# Altium schematic sheet 2.Arduino Pinout.SchDoc
size A4
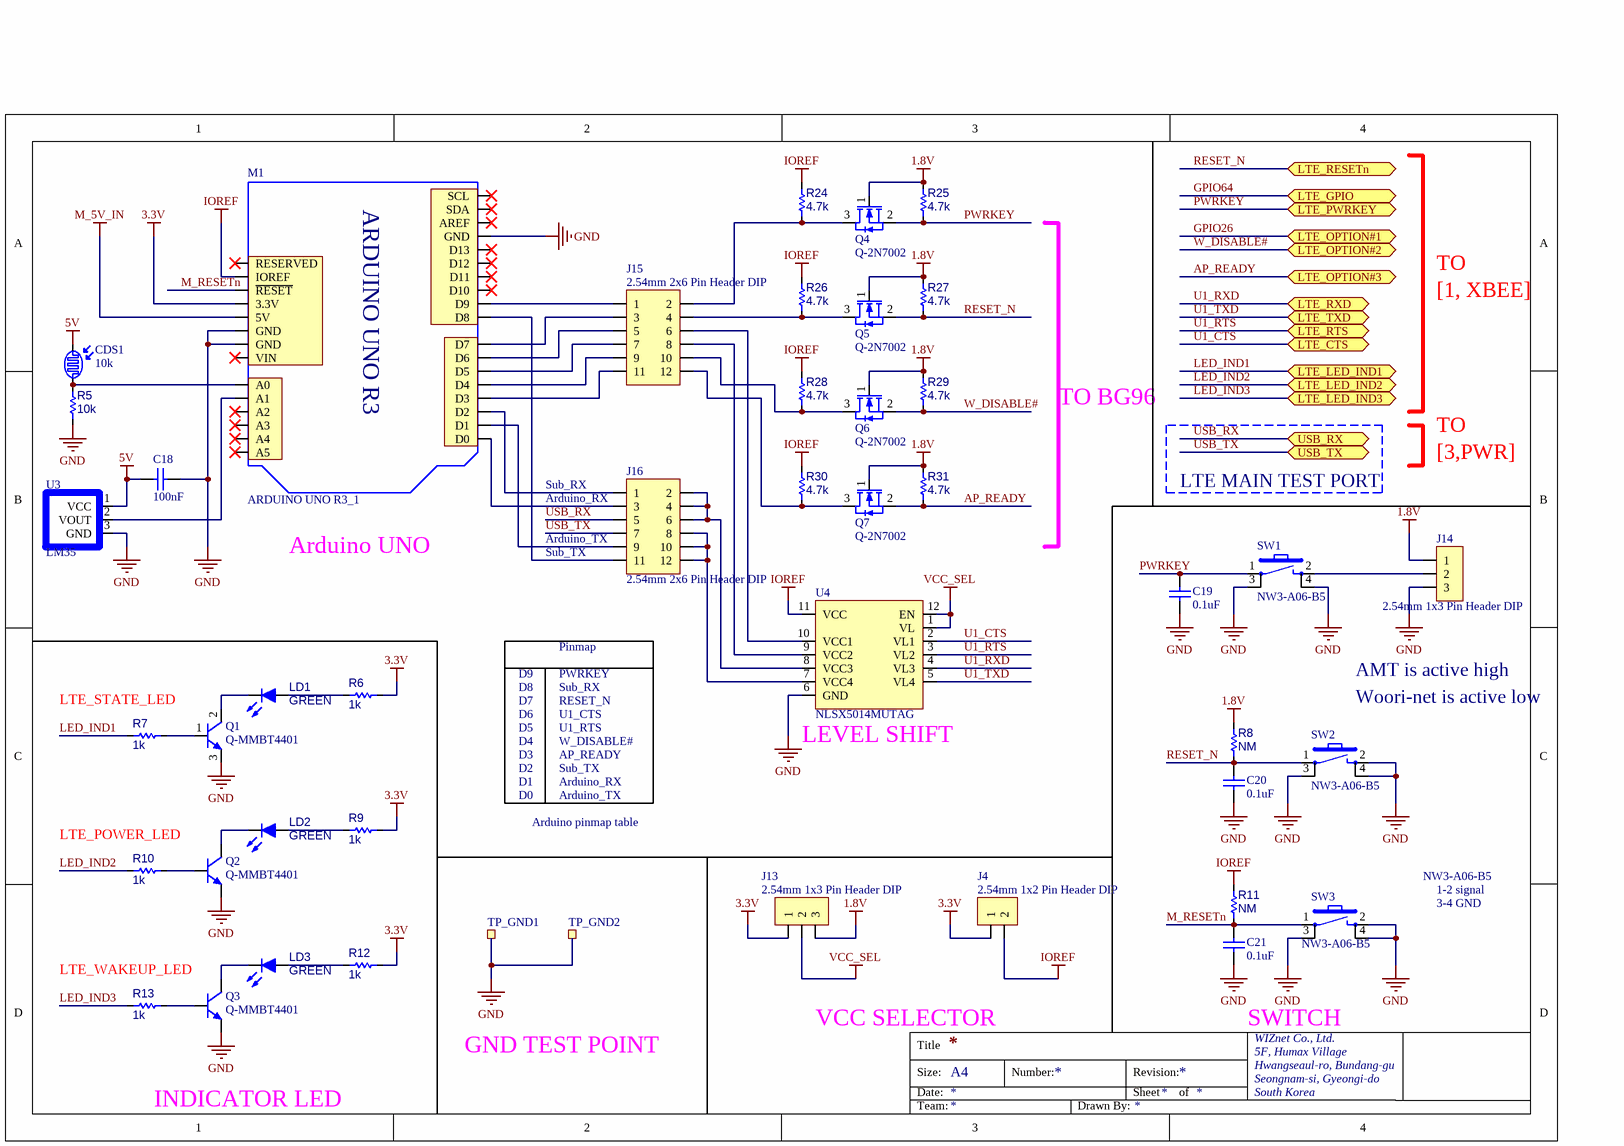
[diagram p0: 2.Arduino Pinout.SchDoc]

## Parts
C18  100nF  [CAP-0603]
C19  0.1uF  [CAP-0402]
C20  0.1uF  [CAP-0402]
C21  0.1uF  [CAP-0402]
CDS1  10k  [GL55]
J4  2.54mm 1x2 Pin Header DIP  [IDC-1X2]
J13  2.54mm 1x3 Pin Header DIP  [IDC-1X3]
J14  2.54mm 1x3 Pin Header DIP  [IDC-1X3]
J15  2.54mm 2x6 Pin Header DIP  [IDC-2X6]
J16  2.54mm 2x6 Pin Header DIP  [IDC-2X6]
LD1  GREEN  [LED-0603-GREEN]
LD2  GREEN  [LED-0603-GREEN]
LD3  GREEN  [LED-0603-GREEN]
M1  ARDUINO UNO R3_1  [ARDUINOR3_ICSP(4)]
Q1  Q-MMBT4401  [SOT-23-3LL]
Q2  Q-MMBT4401  [SOT-23-3LL]
Q3  Q-MMBT4401  [SOT-23-3LL]
Q4  Q-2N7002  [SOT-23-3L]
Q5  Q-2N7002  [SOT-23-3L]
Q6  Q-2N7002  [SOT-23-3L]
Q7  Q-2N7002  [SOT-23-3L]
R5  10k  [RES-0603]
R6  1k  [RES-0402]
R7  1k  [RES-0402]
R8  NM  [RES-0402]
R9  1k  [RES-0402]
R10  1k  [RES-0402]
R11  NM  [RES-0402]
R12  1k  [RES-0402]
R13  1k  [RES-0402]
R24  4.7k  [RES-0402]
R25  4.7k  [RES-0402]
R26  4.7k  [RES-0402]
R27  4.7k  [RES-0402]
R28  4.7k  [RES-0402]
R29  4.7k  [RES-0402]
R30  4.7k  [RES-0402]
R31  4.7k  [RES-0402]
SW1  NW3-A06-B5  [NW3-A06]
SW2  NW3-A06-B5  [NW3-A06]
SW3  NW3-A06-B5  [NW3-A06]
TP_GND1  TESTPOINT  [TP]  (value not drawn)
TP_GND2  TESTPOINT  [TP]  (value not drawn)
U3  LM35  [TO-92]
U4  NLSX5014MUTAG  [UQFN12(0.4/1.7X2)]

## Ports
LTE_CTS, LTE_GPIO, LTE_LED_IND1, LTE_LED_IND2, LTE_LED_IND3, LTE_OPTION#1, LTE_OPTION#2, LTE_OPTION#3, LTE_PWRKEY, LTE_RESETn, LTE_RTS, LTE_RXD, LTE_TXD, USB_RX, USB_TX

## Nets
1.8V: J13.3 J14.1 Q4.1(G) Q5.1(G) Q6.1(G) Q7.1(G) R8.2 R25.2 R27.2 R29.2 R31.2
3.3V: J4.1 J13.1 M1.3.3V R6.2 R9.2 R12.2
5V: C18.2 CDS1.1 U3.1(VCC)
GND: C18.1 C19.1 C20.1 C21.1 J14.3 M1.GND1(GND) M1.GND2(GND) M1.GND4(GND) Q1.3(E) Q2.3(E) Q3.3(E) R5.1 SW1.3(GND) SW1.4(GND) SW2.2 SW2.3(GND) SW2.4(GND) SW3.2 SW3.3(GND) SW3.4(GND) TP_GND1.1(TETSPOINT) TP_GND2.1(TETSPOINT) U3.3(GND) U4.6(GND)
IOREF: J4.2 M1.IOREF R11.2 R24.2 R26.2 R28.2 R30.2 U4.11(VCC)
M_5V_IN: M1.5V
VCC_SEL: J13.2 U4.1(VL) U4.12(EN)
AP_READY: Q7.2(S) R31.1 ; port LTE_OPTION#3
GPIO26: port LTE_OPTION#1
GPIO64: port LTE_GPIO
LED_IND1: R7.1 ; port LTE_LED_IND1
LED_IND2: R10.1 ; port LTE_LED_IND2
LED_IND3: R13.1 ; port LTE_LED_IND3
M_RESETn: C21.2 M1.\RESET(~{RESET}) R11.1 SW3.1
PWRKEY: C19.2 Q4.2(S) R25.1 SW1.1 ; port LTE_PWRKEY
RESET_N: C20.2 Q5.2(S) R8.1 R27.1 SW2.1 ; port LTE_RESETn
U1_CTS: U4.2(VL1) ; port LTE_CTS
U1_RTS: U4.3(VL2) ; port LTE_RTS
U1_RXD: U4.4(VL3) ; port LTE_RXD
U1_TXD: U4.5(VL4) ; port LTE_TXD
USB_RX: J16.5 ; port USB_RX
USB_TX: J16.7 ; port USB_TX
W_DISABLE#: Q6.2(S) R29.1 ; port LTE_OPTION#2
NetCDS1_2: CDS1.2 M1.A0 R5.2
NetJ14_2: J14.2 SW1.2
NetJ15_1: J15.1 M1.D9
NetJ15_2: J15.2 Q4.3(D) R24.1
NetJ15_3: J15.3 M1.D7
NetJ15_4: J15.4 Q5.3(D) R26.1
NetJ15_5: J15.5 M1.D6
NetJ15_6: J15.6 U4.10(VCC1)
NetJ15_7: J15.7 M1.D5
NetJ15_8: J15.8 U4.9(VCC2)
NetJ15_9: J15.9 M1.D4
NetJ15_10: J15.10 Q6.3(D) R28.1
NetJ15_11: J15.11 M1.D3
NetJ15_12: J15.12 Q7.3(D) R30.1
NetJ16_1: J16.1 M1.D2
NetJ16_2: J16.2 J16.4 J16.6 U4.8(VCC3)
NetJ16_3: J16.3 M1.D0
NetJ16_8: J16.8 J16.10 J16.12 U4.7(VCC4)
NetJ16_9: J16.9 M1.D1
NetJ16_11: J16.11 M1.D8
NetLD1_1: LD1.1(A) R6.1
NetLD1_2: LD1.2(K) Q1.2(C)
NetLD2_1: LD2.1(A) R9.1
NetLD2_2: LD2.2(K) Q2.2(C)
NetLD3_1: LD3.1(A) R12.1
NetLD3_2: LD3.2(K) Q3.2(C)
NetM1_A1: M1.A1 U3.2(VOUT)
NetQ1_1: Q1.1(B) R7.2
NetQ2_1: Q2.1(B) R10.2
NetQ3_1: Q3.1(B) R13.2

Not connected (* = marked no-connect by the designer): M1 A2* A3* A4* A5* AREF* D10* D11* D12* D13* RESERVED* SCL* SDA* VIN*

## Notes on the sheet
- TO
- [1, XBEE]
- TO BG96
- (near J16) Sub_RX
- LTE MAIN TEST PORT
- [3,PWR]
- Arduino UNO
- (near J16) Arduino_RX
- (near J16) Arduino_TX
- (near J16) Sub_TX
- D8
- D9
- Sub_RX
- PWRKEY
- Pinmap
- AMT is active high
- (near R7) LTE_STATE_LED
- D7
- D6
- D5
- D4
- D3
- RESET_N
- U1_CTS
- U1_RTS
- W_DISABLE#
- AP_READY
- (near U4) LEVEL SHIFT
- Woori-net is active low
- D2
- D1
- D0
- Arduino pinmap table
- Sub_TX
- Arduino_RX
- Arduino_TX
- (near R10) LTE_POWER_LED
- NW3-A06-B5
- 1-2 signal
- 3-4 GND
- (near R13) LTE_WAKEUP_LED
- VCC SELECTOR
- SWITCH
- GND TEST POINT
- INDICATOR LED
- Title
- Size:
- Date:
- A4
- Number:
- Revision:
- Sheet
- of
- WIZnet Co., Ltd.
- 5F, Humax Village
- Hwangseaul-ro, Bundang-gu
- Seongnam-si, Gyeongi-do
- South Korea
- Team:
- Drawn By:
- (in symbol ARDUINO UNO R3_1) ARDUINO UNO R3

## Library data of the parts
C18 = CAP-0603: Ceramic CAP 0603(1608)
C19-C21 = CAP-0402: Ceramic CAP 0402(1005)
CDS1 = CDS
LD1-LD3 = LED-0603
M1 = ARDUINO UNO R3_1: Arduino UNO R3
Q1-Q3 = Q-MMBT4401: NPN General-Purpose Amplifier
Q4-Q7 = Q-2N7002: N-Channel 60-V (D-S) MOSFET
R5 = RES-0603: RES0603
R6-R13 R24-R31 = RES-0402
SW1-SW3 = SWITCH-ANGLE_TACT: Angle TACT SW, SMD
TP_GND1 TP_GND2 = TESTPOINT: TEST POINT
U4 = NLSX5014MUTAG: Level-Shifter